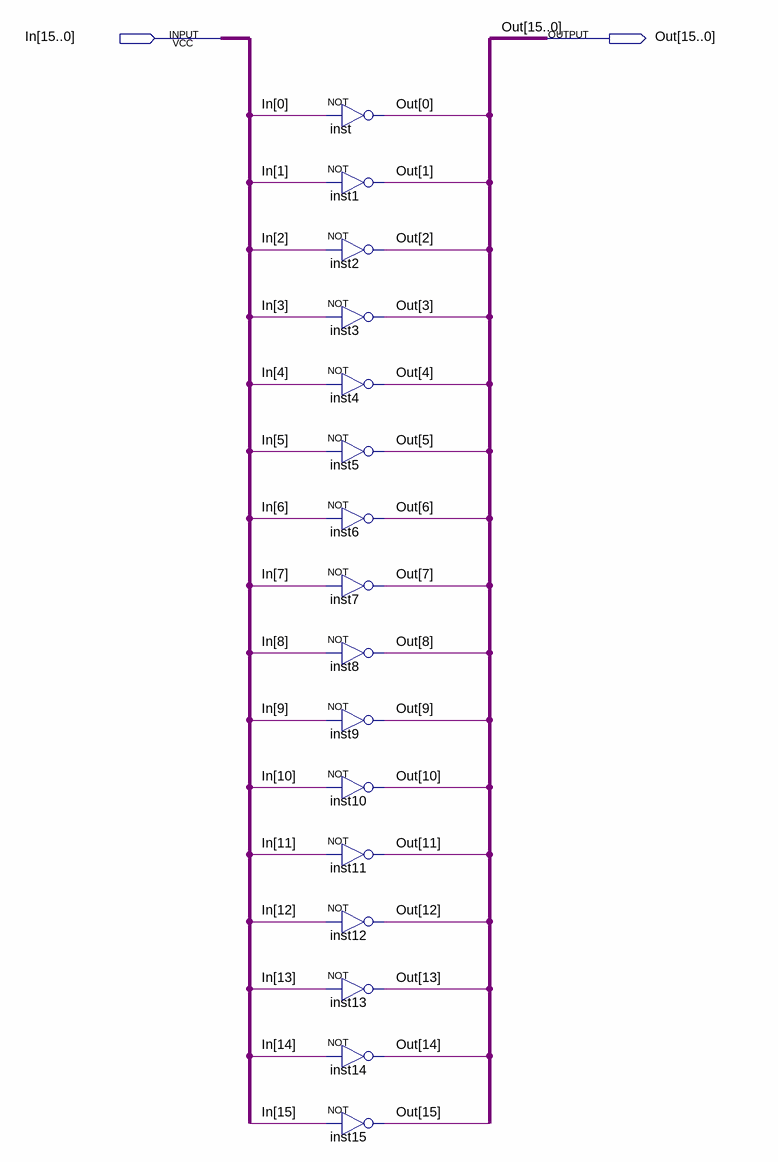
[diagram p0: schematic sheet]
// Quartus schematic Not_16bit.bdf as structural Verilog: 16 symbols, 2 pins
module Not_16bit (
  input  [15:0] In,
  output [15:0] Out
);

  not inst (Out[0], In[0]);
  not inst1 (Out[1], In[1]);
  not inst2 (Out[2], In[2]);
  not inst3 (Out[3], In[3]);
  not inst4 (Out[4], In[4]);
  not inst5 (Out[5], In[5]);
  not inst6 (Out[6], In[6]);
  not inst7 (Out[7], In[7]);
  not inst8 (Out[8], In[8]);
  not inst9 (Out[9], In[9]);
  not inst10 (Out[10], In[10]);
  not inst11 (Out[11], In[11]);
  not inst12 (Out[12], In[12]);
  not inst13 (Out[13], In[13]);
  not inst14 (Out[14], In[14]);
  not inst15 (Out[15], In[15]);
endmodule
